# Altium schematic sheet A1-A2 Switches new.SchDoc: A1-A2 Switches new
size D; DrawnBy: C. Lewis; Engineer: C. Lewis; Address1: 4650 NORRIS CANYON RD.; Address2: SAN RAMON, CA 94583; DocumentNumber: 35133; Revision: D; SheetNumber: 6; SheetTotal: 20; PageSetup: Record=PageOptions|CenterHorizontal=True|CenterVertical=True|PrintScale=0.51|XCorrection=1.00|YCorrection=1.00|PrintKind=0|BorderSize=5000000|LeftOffset=0|BottomOffset=0|Orientation=2|PaperLength=1000|PaperWidth=1000|Scale=100|PaperSource=257|PrintQuality=600|MediaType=1|DitherType=10|PaperKind=11x17|PrintScaleMode=1
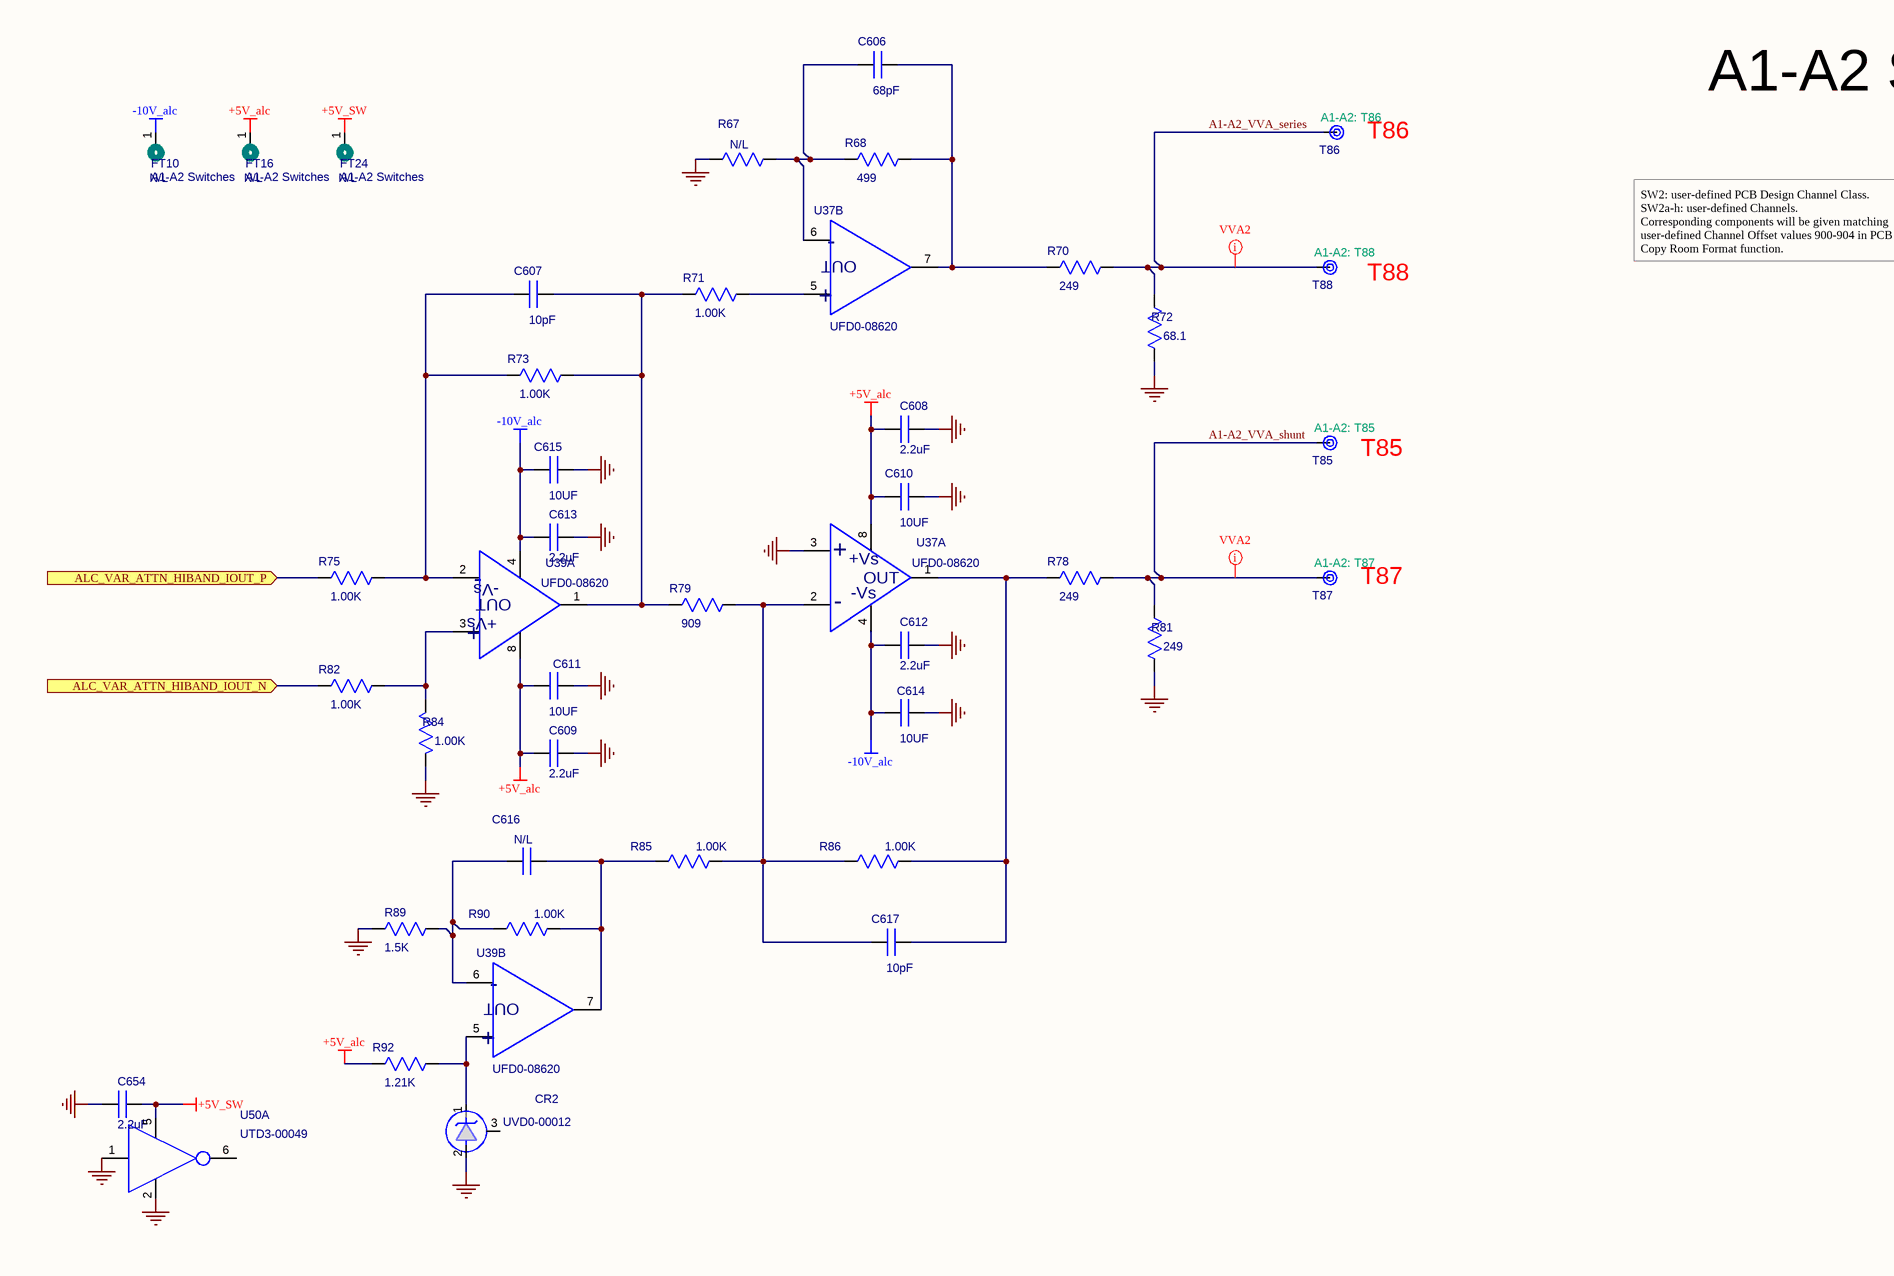
[diagram p0: A1-A2 Switches new.SchDoc, top left]
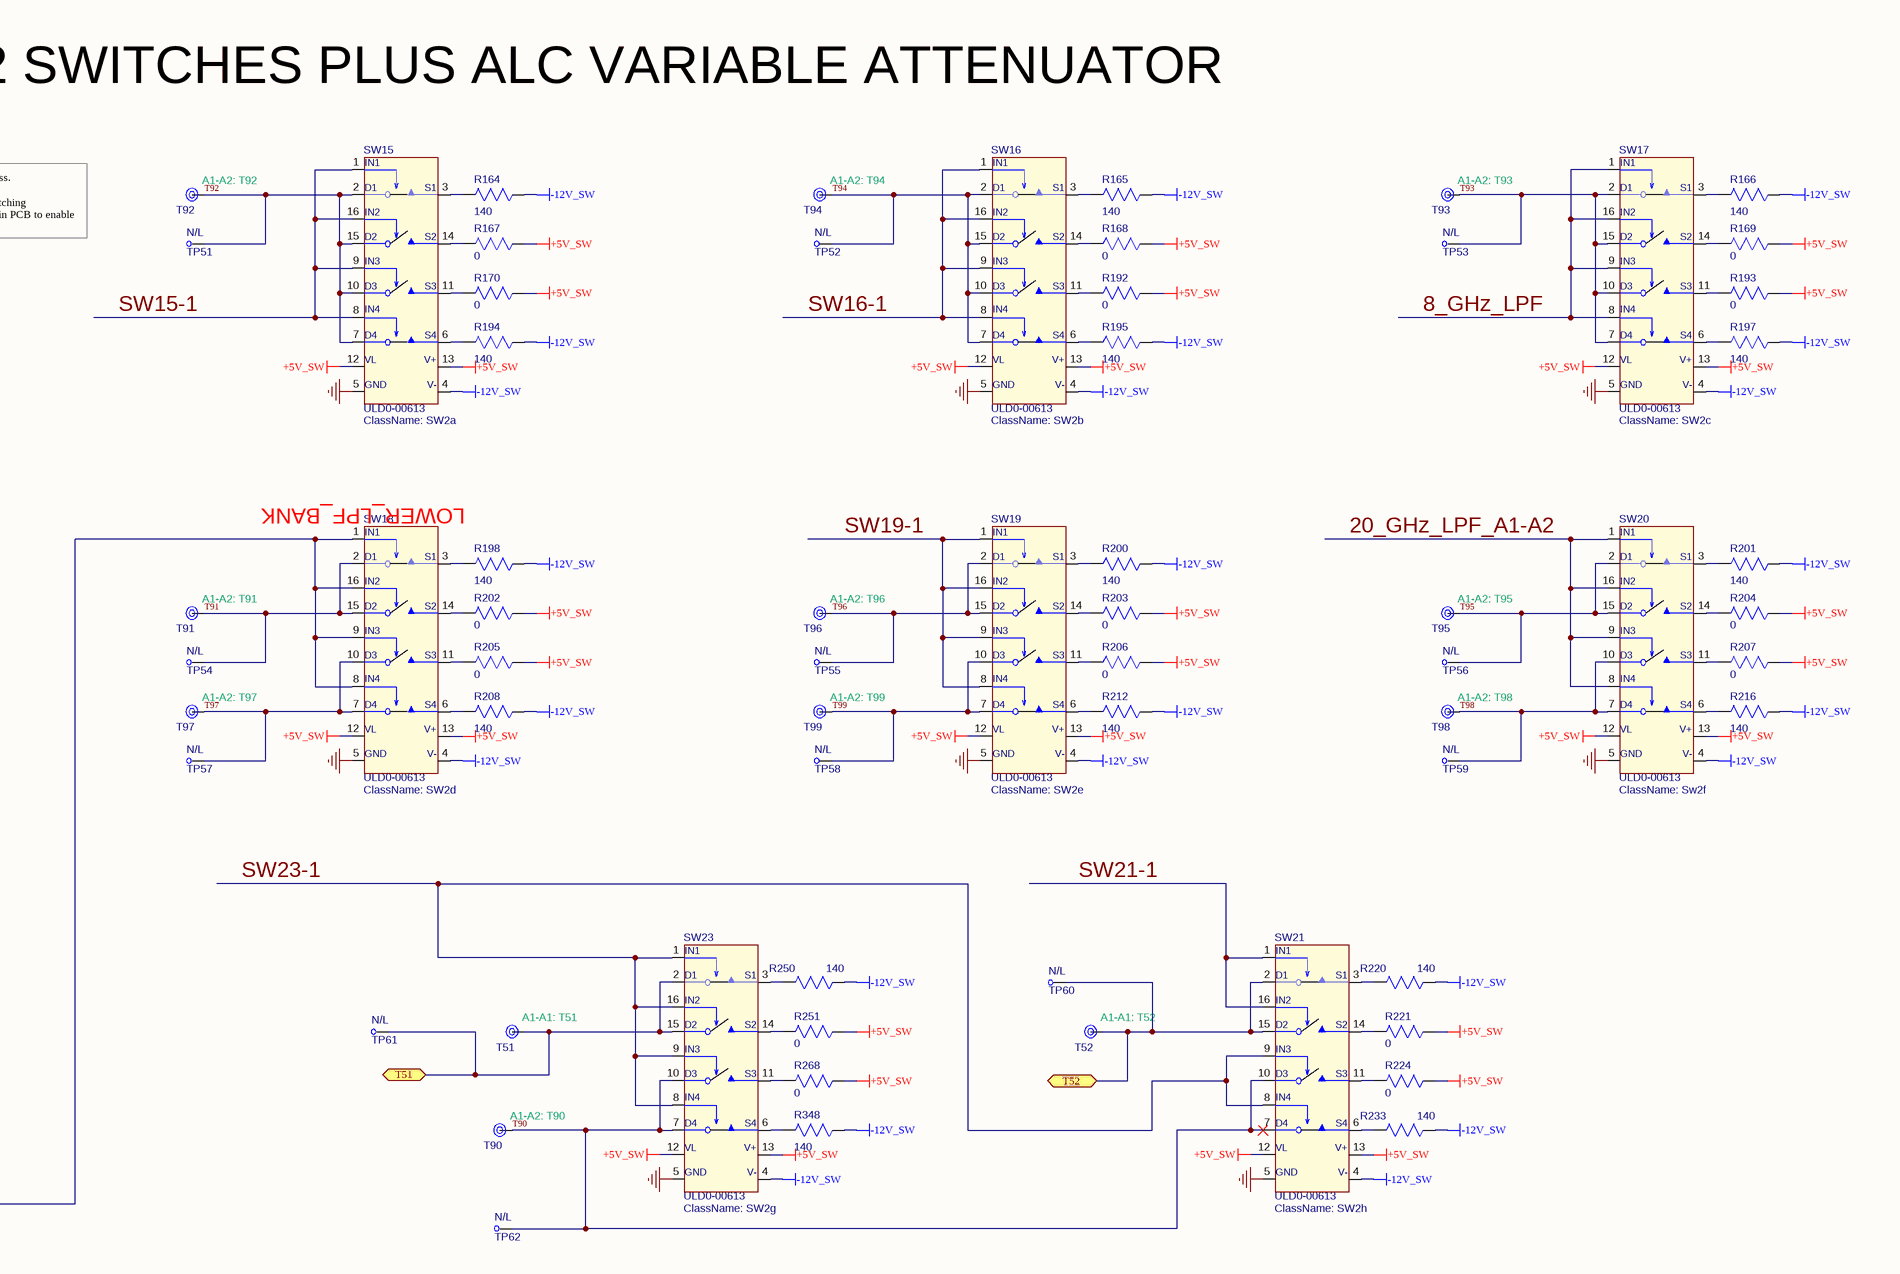
[diagram p1: A1-A2 Switches new.SchDoc, top right]
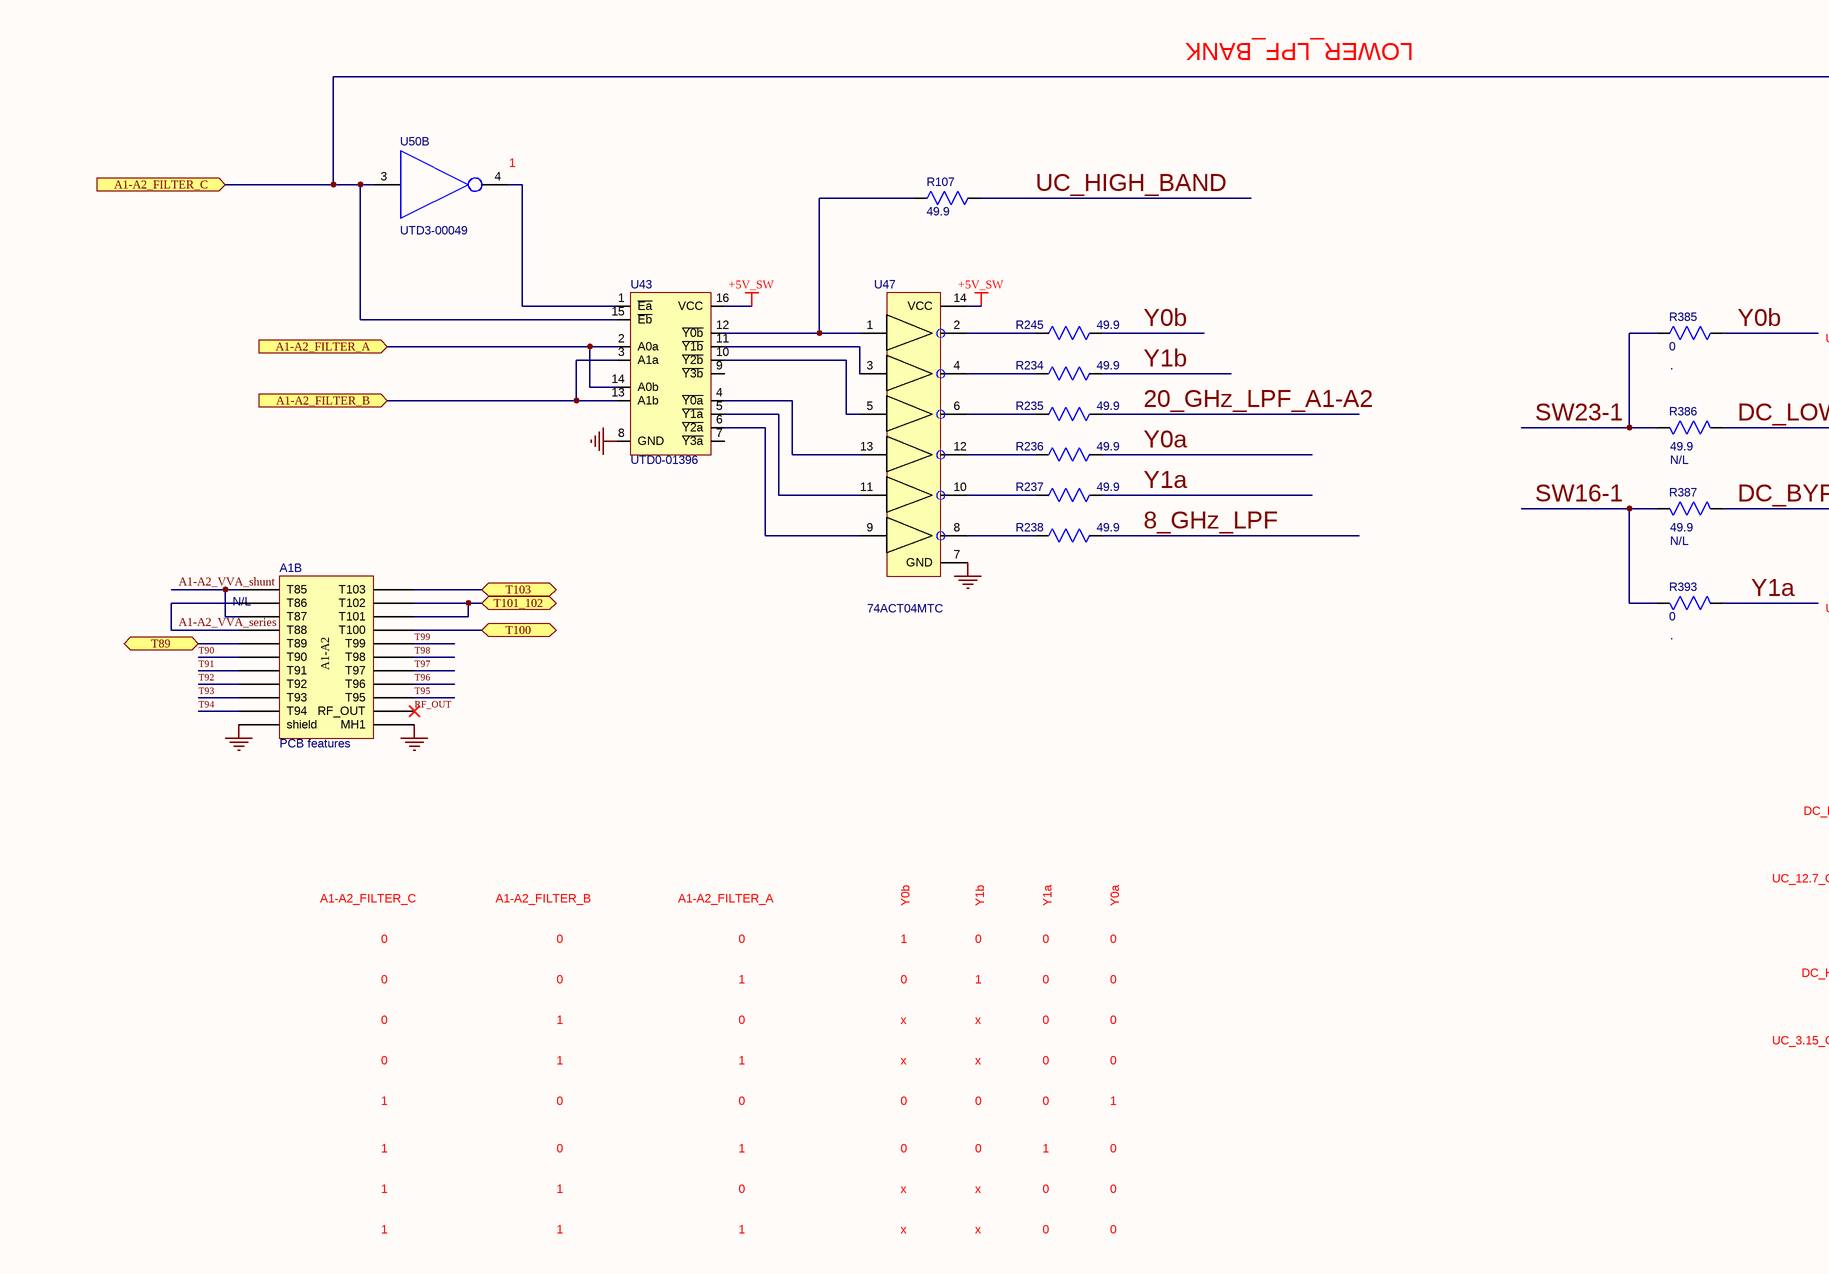
[diagram p2: A1-A2 Switches new.SchDoc, bottom left]
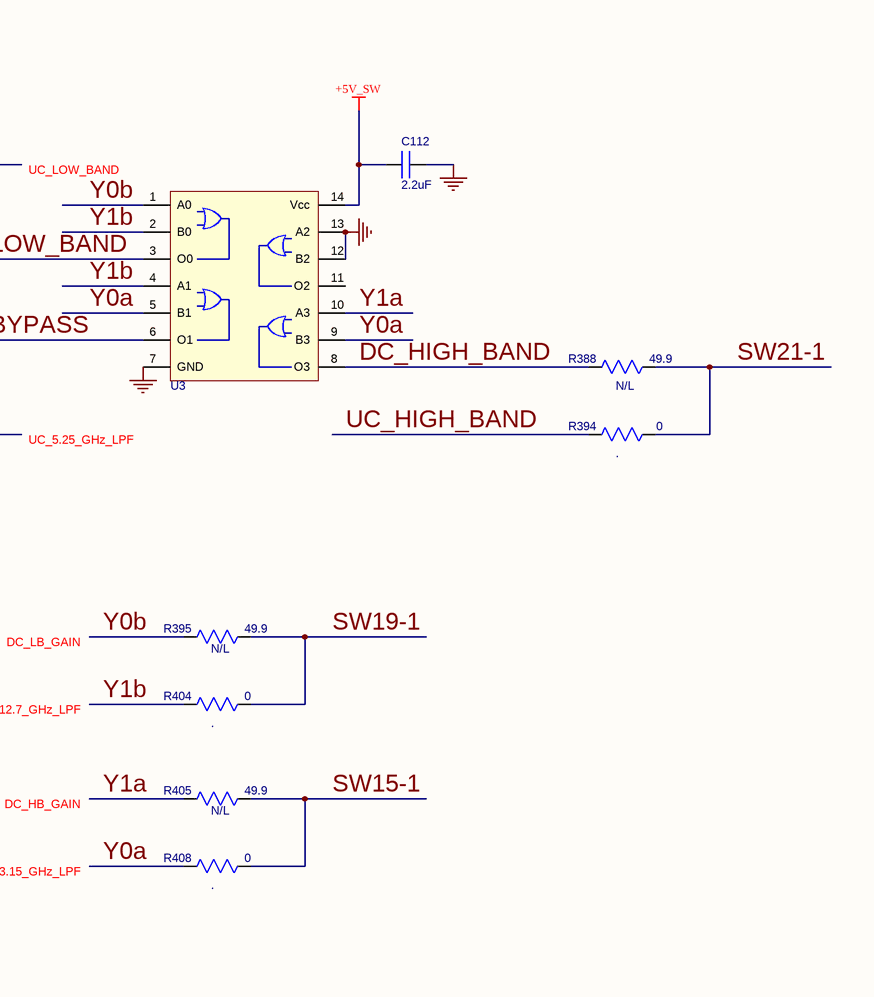
[diagram p3: A1-A2 Switches new.SchDoc, bottom right]

## Parts
A1  PCB features  NoLoad: N/L  [Hydra_A1_output_modules]  (part B of 2)  (no BOM)
C112  value 2.2uF  [CAP-0603-H035-N]  (hidden comment: CAP,CHP,2.2UF,10%,X5R;16V)
C606  value 68pF  [CAP-0402-N]  (hidden comment: 68pF;5%;COG;50V;CHIP;0402)
C607  value 10pF  [CAP-0402-N]  (hidden comment: 10 PF;5%;COG;>50V;CHIP;0402)
C608  value 2.2uF  [CAP-0603-H035-N]  (hidden comment: CAP,CHP,2.2UF,10%,X5R;16V)
C609  value 2.2uF  [CAP-0603-H035-N]  (hidden comment: CAP,CHP,2.2UF,10%,X5R;16V)
C610  10UF  [CAP-1210-N]
C611  10UF  [CAP-1210-N]
C612  value 2.2uF  [CAP-0603-H035-N]  (hidden comment: CAP,CHP,2.2UF,10%,X5R;16V)
C613  value 2.2uF  [CAP-0603-H035-N]  (hidden comment: CAP,CHP,2.2UF,10%,X5R;16V)
C614  10UF  [CAP-1210-N]
C615  10UF  [CAP-1210-N]
C616  NoLoad: N/L  [CAP-0402-N]  (hidden comment: 2.2pF;5%;COG;50V;CHIP;0402)
C617  value 10pF  [CAP-0402-N]  (hidden comment: 10 PF;5%;COG;>50V;CHIP;0402)
C654  value 2.2uF  [CAP-0603-H035-N]  (hidden comment: CAP,CHP,2.2UF,10%,X5R;16V)
CR2  VREF;1.235V;+/-4MV;.2MV 0-70 DEG C;SOT-23  [SOT23-N]  (value not drawn)
FT10  A1-A2 Switches  NoLoad: N/L  [FromToNode_ML2]  (net tie, no BOM)
FT16  A1-A2 Switches  NoLoad: N/L  [FromToNode_ML2]  (net tie, no BOM)
FT24  A1-A2 Switches  NoLoad: N/L  [FromToNode_ML2]  (net tie, no BOM)
R67  NoLoad: N/L  [RES-0402-N]  (hidden comment: 32.4K OHMS;.06W;1%;200PPM;FILM;CHIP;0402)
R68  value 499  [RES-0402-N]  (hidden comment: 499 OHMS; 1%; .1W; 100PPM; FILM; CHIP; 0402)
R70  value 249  [RES-0402-N]  (hidden comment: 249 OHMS; 1%; .1W; 100PPM; FILM; CHIP; 0402)
R71  value 1.00K  [RES-0402-N]  (hidden comment: 1.0K OHMS;.06W;1%;200PPM;FILM;CHIP;0402)
R72  value 68.1  [RES-0402-N]  (hidden comment: 68.1 OHMS;.06W;1%;200PPM;FILM;CHIP;0402)
R73  value 1.00K  [RES-0402-N]  (hidden comment: 1.0K OHMS;.06W;1%;200PPM;FILM;CHIP;0402)
R75  value 1.00K  [RES-0402-N]  (hidden comment: 1.0K OHMS;.06W;1%;200PPM;FILM;CHIP;0402)
R78  value 249  [RES-0402-N]  (hidden comment: 249 OHMS; 1%; .1W; 100PPM; FILM; CHIP; 0402)
R79  value 909  [RES-0402-N]  (hidden comment: 909 OHMS; 1%; .1W; 100PPM; FILM; CHIP; 0402)
R81  value 249  [RES-0402-N]  (hidden comment: 249 OHMS; 1%; .1W; 100PPM; FILM; CHIP; 0402)
R82  value 1.00K  [RES-0402-N]  (hidden comment: 1.0K OHMS;.06W;1%;200PPM;FILM;CHIP;0402)
R84  value 1.00K  [RES-0402-N]  (hidden comment: 1.0K OHMS;.06W;1%;200PPM;FILM;CHIP;0402)
R85  value 1.00K  [RES-0402-N]  (hidden comment: 1.0K OHMS;.06W;1%;200PPM;FILM;CHIP;0402)
R86  value 1.00K  [RES-0402-N]  (hidden comment: 1.0K OHMS;.06W;1%;200PPM;FILM;CHIP;0402)
R89  value 1.5K  [RES-0402-N]  (hidden comment: 1.50K Ohms;.06W;1%;±100PPM;CHIP RES;0402)
R90  value 1.00K  [RES-0402-N]  (hidden comment: 1.0K OHMS;.06W;1%;200PPM;FILM;CHIP;0402)
R92  value 1.21K  [RES-0402-N]  (hidden comment: 1.21K OHMS;.06W;1%;200PPM;FILM;CHIP;0402)
R107  value 49.9  [RES-0402-N]  (hidden comment: 49.9 OHMS;.06W;1%;200PPM;FILM;CHIP;0402)
R164  value 140  [RES-0402-N]  (hidden comment: 140 OHMS; 1%; .1W; 100PPM; FILM; CHIP; 0402)
R165  value 140  [RES-0402-N]  (hidden comment: 140 OHMS; 1%; .1W; 100PPM; FILM; CHIP; 0402)
R166  value 140  [RES-0402-N]  (hidden comment: 140 OHMS; 1%; .1W; 100PPM; FILM; CHIP; 0402)
R167  value 0  [RES-0603-N]  (hidden comment: JUMPER;.05 OHMS MAX;1A MAX;0603)
R168  value 0  [RES-0603-N]  (hidden comment: JUMPER;.05 OHMS MAX;1A MAX;0603)
R169  value 0  [RES-0603-N]  (hidden comment: JUMPER;.05 OHMS MAX;1A MAX;0603)
R170  value 0  [RES-0603-N]  (hidden comment: JUMPER;.05 OHMS MAX;1A MAX;0603)
R192  value 0  [RES-0603-N]  (hidden comment: JUMPER;.05 OHMS MAX;1A MAX;0603)
R193  value 0  [RES-0603-N]  (hidden comment: JUMPER;.05 OHMS MAX;1A MAX;0603)
R194  value 140  [RES-0402-N]  (hidden comment: 140 OHMS; 1%; .1W; 100PPM; FILM; CHIP; 0402)
R195  value 140  [RES-0402-N]  (hidden comment: 140 OHMS; 1%; .1W; 100PPM; FILM; CHIP; 0402)
R197  value 140  [RES-0402-N]  (hidden comment: 140 OHMS; 1%; .1W; 100PPM; FILM; CHIP; 0402)
R198  value 140  [RES-0402-N]  (hidden comment: 140 OHMS; 1%; .1W; 100PPM; FILM; CHIP; 0402)
R200  value 140  [RES-0402-N]  (hidden comment: 140 OHMS; 1%; .1W; 100PPM; FILM; CHIP; 0402)
R201  value 140  [RES-0402-N]  (hidden comment: 140 OHMS; 1%; .1W; 100PPM; FILM; CHIP; 0402)
R202  value 0  [RES-0603-N]  (hidden comment: JUMPER;.05 OHMS MAX;1A MAX;0603)
R203  value 0  [RES-0603-N]  (hidden comment: JUMPER;.05 OHMS MAX;1A MAX;0603)
R204  value 0  [RES-0603-N]  (hidden comment: JUMPER;.05 OHMS MAX;1A MAX;0603)
R205  value 0  [RES-0603-N]  (hidden comment: JUMPER;.05 OHMS MAX;1A MAX;0603)
R206  value 0  [RES-0603-N]  (hidden comment: JUMPER;.05 OHMS MAX;1A MAX;0603)
R207  value 0  [RES-0603-N]  (hidden comment: JUMPER;.05 OHMS MAX;1A MAX;0603)
R208  value 140  [RES-0402-N]  (hidden comment: 140 OHMS; 1%; .1W; 100PPM; FILM; CHIP; 0402)
R212  value 140  [RES-0402-N]  (hidden comment: 140 OHMS; 1%; .1W; 100PPM; FILM; CHIP; 0402)
R216  value 140  [RES-0402-N]  (hidden comment: 140 OHMS; 1%; .1W; 100PPM; FILM; CHIP; 0402)
R220  value 140  [RES-0603-N]  (hidden comment: 140 OHMS;.1W;1%;200PPM;FILM;CHIP;0603)
R221  value 0  [RES-0603-N]  (hidden comment: JUMPER;.05 OHMS MAX;1A MAX;0603)
R224  value 0  [RES-0603-N]  (hidden comment: JUMPER;.05 OHMS MAX;1A MAX;0603)
R233  value 140  [RES-0603-N]  (hidden comment: 140 OHMS;.1W;1%;200PPM;FILM;CHIP;0603)
R234  value 49.9  [RES-0402-N]  (hidden comment: 49.9 OHMS;.06W;1%;200PPM;FILM;CHIP;0402)
R235  value 49.9  [RES-0402-N]  (hidden comment: 49.9 OHMS;.06W;1%;200PPM;FILM;CHIP;0402)
R236  value 49.9  [RES-0402-N]  (hidden comment: 49.9 OHMS;.06W;1%;200PPM;FILM;CHIP;0402)
R237  value 49.9  [RES-0402-N]  (hidden comment: 49.9 OHMS;.06W;1%;200PPM;FILM;CHIP;0402)
R238  value 49.9  [RES-0402-N]  (hidden comment: 49.9 OHMS;.06W;1%;200PPM;FILM;CHIP;0402)
R245  value 49.9  [RES-0402-N]  (hidden comment: 49.9 OHMS;.06W;1%;200PPM;FILM;CHIP;0402)
R250  value 140  [RES-0603-N]  (hidden comment: 140 OHMS;.1W;1%;200PPM;FILM;CHIP;0603)
R251  value 0  [RES-0603-N]  (hidden comment: JUMPER;.05 OHMS MAX;1A MAX;0603)
R268  value 0  [RES-0603-N]  (hidden comment: JUMPER;.05 OHMS MAX;1A MAX;0603)
R348  value 140  [RES-0402-N]  (hidden comment: 140 OHMS; 1%; .1W; 100PPM; FILM; CHIP; 0402)
R385  UC_LOW_BAND  value 0  NoLoad: .  [RES-0402-N]
R386  value 49.9  NoLoad: N/L  [RES-0402-N]  (hidden comment: DC_LOW_BAND)
R387  value 49.9  NoLoad: N/L  [RES-0402-N]  (hidden comment: DC_BYPASS)
R388  value 49.9  NoLoad: N/L  [RES-0402-N]  (hidden comment: DC_HIGH_BAND)
R393  UC_5.25_GHz_LPF  value 0  NoLoad: .  [RES-0402-N]
R394  value 0  NoLoad: .  [RES-0402-N]  (hidden comment: UC_HIGH_BAND)
R395  DC_LB_GAIN  value 49.9  NoLoad: N/L  [RES-0402-N]
R404  UC_12.7_GHz_LPF  value 0  NoLoad: .  [RES-0402-N]
R405  DC_HB_GAIN  value 49.9  NoLoad: N/L  [RES-0402-N]
R408  UC_3.15_GHz_LPF  value 0  NoLoad: .  [RES-0402-N]
SW15  G_PN: ULD0-00613  ClassName: SW2a  [SOIC-16_Vishay]  (hidden comment: QUAD SPST ANALOG SW;200NS;45 OHM;SO-16)
SW16  G_PN: ULD0-00613  ClassName: SW2b  [SOIC-16_Vishay]  (hidden comment: QUAD SPST ANALOG SW;200NS;45 OHM;SO-16)
SW17  G_PN: ULD0-00613  ClassName: SW2c  [SOIC-16_Vishay]  (hidden comment: QUAD SPST ANALOG SW;200NS;45 OHM;SO-16)
SW18  G_PN: ULD0-00613  ClassName: SW2d  [SOIC-16_Vishay]  (hidden comment: QUAD SPST ANALOG SW;200NS;45 OHM;SO-16)
SW19  G_PN: ULD0-00613  ClassName: SW2e  [SOIC-16_Vishay]  (hidden comment: QUAD SPST ANALOG SW;200NS;45 OHM;SO-16)
SW20  G_PN: ULD0-00613  ClassName: Sw2f  [SOIC-16_Vishay]  (hidden comment: QUAD SPST ANALOG SW;200NS;45 OHM;SO-16)
SW21  G_PN: ULD0-00613  ClassName: SW2h  [SOIC-16_Vishay]  (hidden comment: QUAD SPST ANALOG SW;200NS;45 OHM;SO-16)
SW23  G_PN: ULD0-00613  ClassName: SW2g  [SOIC-16_Vishay]  (hidden comment: QUAD SPST ANALOG SW;200NS;45 OHM;SO-16)
T51  A1-A1: T51  [JIB0-11254]
T52  A1-A1: T52  [JIB0-11254]
T85  A1-A2: T85  [JIB0-11254]
T86  A1-A2: T86  [JIB0-11254]
T87  A1-A2: T87  [JIB0-11254]
T88  A1-A2: T88  [JIB0-11254]
T90  A1-A2: T90  [JIB0-11254]
T91  A1-A2: T91  [JIB0-11254]
T92  A1-A2: T92  [JIB0-11254]
T93  A1-A2: T93  [JIB0-11254]
T94  A1-A2: T94  [JIB0-11254]
T95  A1-A2: T95  [JIB0-11254]
T96  A1-A2: T96  [JIB0-11254]
T97  A1-A2: T97  [JIB0-11254]
T98  A1-A2: T98  [JIB0-11254]
T99  A1-A2: T99  [JIB0-11254]
TP51  NoLoad: N/L  [TP-060]  (hidden comment: .)  (no BOM)
TP52  NoLoad: N/L  [TP-060]  (hidden comment: .)  (no BOM)
TP53  NoLoad: N/L  [TP-060]  (hidden comment: .)  (no BOM)
TP54  NoLoad: N/L  [TP-060]  (hidden comment: .)  (no BOM)
TP55  NoLoad: N/L  [TP-060]  (hidden comment: .)  (no BOM)
TP56  NoLoad: N/L  [TP-060]  (hidden comment: .)  (no BOM)
TP57  NoLoad: N/L  [TP-060]  (hidden comment: .)  (no BOM)
TP58  NoLoad: N/L  [TP-060]  (hidden comment: .)  (no BOM)
TP59  NoLoad: N/L  [TP-060]  (hidden comment: .)  (no BOM)
TP60  NoLoad: N/L  [TP-060]  (hidden comment: .)  (no BOM)
TP61  NoLoad: N/L  [TP-060]  (hidden comment: .)  (no BOM)
TP62  NoLoad: N/L  [TP-060]  (hidden comment: .)  (no BOM)
U3  QUAD 2 IN OR GATES  [TSSOP-14_ON_SEMI]  (value not drawn)
U37  OP-AMP;DUAL:PRECISION;LOW CURRENT;LOW NOISE;WIDE  [SO8_MS-012]  (value not drawn)  (parts A,B of 2)
U39  OP-AMP;DUAL:PRECISION;LOW CURRENT;LOW NOISE;WIDE  [SO8_MS-012]  (value not drawn)  (parts A,B of 2)
U43  UTD0-01396  [TSSOP-16_ONSEMI]
U47  M_PN: 74ACT04MTC  [TSOP65P640X120-14L]  (hidden comment: 74ACT04MTC HEX INVERTER;SMT;TSSOP-14)
U50  INVERTER;DUAL;1.65-5.5V SUP;2NS TPD;SC70-6  [SOT-363_419B]  (value not drawn)  (parts A,B of 2)

## Ports
A1-A2_FILTER_A, A1-A2_FILTER_B, A1-A2_FILTER_C, ALC_VAR_ATTN_HIBAND_IOUT_N, ALC_VAR_ATTN_HIBAND_IOUT_P, T51, T52, T89, T100, T101_102, T103

## Nets
+5V_alc: C608.1 C609.1 C610.1 C611.1 FT16.1 R92.1 U37.8(V+) U39.8(V+)
+5V_SW: C112.1 C654.1 FT24.1 R167.2 R168.2 R169.2 R170.2 R192.2 R193.2 R202.2 R203.2 R204.2 R205.2 R206.2 R207.2 R221.2 R224.2 R251.2 R268.2 SW15.12(VL) SW15.13(V+) SW16.12(VL) SW16.13(V+) SW17.12(VL) SW17.13(V+) SW18.12(VL) SW18.13(V+) SW19.12(VL) SW19.13(V+) SW20.12(VL) SW20.13(V+) SW21.12(VL) SW21.13(V+) SW23.12(VL) SW23.13(V+) U3.14(Vcc) U43.16(VCC) U47.14(VCC) U50.5(V+)
-10V_alc: C612.1 C613.1 C614.1 C615.1 FT10.1 U37.4(V-) U39.4(V-)
-12V_SW: R164.2 R165.2 R166.2 R194.2 R195.2 R197.2 R198.2 R200.2 R201.2 R208.2 R212.2 R216.2 R220.2 R233.2 R250.2 R348.2 SW15.4(VL) SW16.4(VL) SW17.4(VL) SW18.4(VL) SW19.4(VL) SW20.4(VL) SW21.4(VL) SW23.4(VL)
GND: A1.A1-A2_shield(shield) A1.MH1 C112.2 C608.2 C609.2 C610.2 C611.2 C612.2 C613.2 C614.2 C615.2 C654.2 CR2.2 R67.1 R72.1 R81.1 R84.2 R89.1 SW15.5(IN2) SW16.5(IN2) SW17.5(IN2) SW18.5(IN2) SW19.5(IN2) SW20.5(IN2) SW21.5(IN2) SW23.5(IN2) U3.7(GND) U3.12(B2) U3.13(A2) U37.3(+IN) U43.8(GND) U47.7(GND) U50.1(IN) U50.2(V-)
8_GHz_LPF: R238.2 SW17.1(IN1) SW17.8(IN4) SW17.9(IN3) SW17.16(S1)
20_GHz_LPF_A1-A2: R235.2 SW20.1(IN1) SW20.8(IN4) SW20.9(IN3) SW20.16(S1)
A1-A2_FILTER_A: U43.2(A0a) U43.14(A0b) ; port A1-A2_FILTER_A
A1-A2_FILTER_B: U43.3(A1a) U43.13(A1b) ; port A1-A2_FILTER_B
A1-A2_FILTER_C: SW18.1(IN1) SW18.8(IN4) SW18.9(IN3) SW18.16(S1) U43.15(~{Eb}) U50.3(IN) ; port A1-A2_FILTER_C
A1-A2_VVA_series: A1.T86 A1.T88 R70.2 R72.2 T86.1 T88.1
A1-A2_VVA_shunt: A1.T85 A1.T87 R78.2 R81.2 T85.1 T87.1
ALC_VAR_ATTN_HIBAND_IOUT_N: R82.1 ; port ALC_VAR_ATTN_HIBAND_IOUT_N
ALC_VAR_ATTN_HIBAND_IOUT_P: R75.1 ; port ALC_VAR_ATTN_HIBAND_IOUT_P
DC_BYPASS: R387.1 U3.6(O1)
DC_HIGH_BAND: R388.1 U3.8(O3)
DC_LOW_BAND: R386.1 U3.3(O0)
RF_OUT: A1.MH_RF_OUT(RF_OUT)
SW15-1: R405.2 R408.2 SW15.1(IN1) SW15.8(IN4) SW15.9(IN3) SW15.16(S1)
SW16-1: R387.2 R393.2 SW16.1(IN1) SW16.8(IN4) SW16.9(IN3) SW16.16(S1)
SW19-1: R395.2 R404.2 SW19.1(IN1) SW19.8(IN4) SW19.9(IN3) SW19.16(S1)
SW21-1: R388.2 R394.2 SW21.1(IN1) SW21.16(S1)
SW23-1: R385.2 R386.2 SW21.8(IN4) SW21.9(IN3) SW23.1(IN1) SW23.8(IN4) SW23.9(IN3) SW23.16(S1)
T51: SW23.2(D1) SW23.15(D2) T51.1 TP61.1 ; port T51
T52: SW21.2(D1) SW21.15(D2) T52.1 TP60.1 ; port T52
T89: A1.T89 ; port T89
T90: A1.T90 SW21.7(D4) SW21.10(D3) SW23.7(D4) SW23.10(D3) T90.1 TP62.1
T91: A1.T91 SW18.2(D1) SW18.15(D2) T91.1 TP54.1
T92: A1.T92 SW15.2(D1) SW15.7(D4) SW15.10(D3) SW15.15(D2) T92.1 TP51.1
T93: A1.T93 SW17.2(D1) SW17.7(D4) SW17.10(D3) SW17.15(D2) T93.1 TP53.1
T94: A1.T94 SW16.2(D1) SW16.7(D4) SW16.10(D3) SW16.15(D2) T94.1 TP52.1
T95: A1.T95 SW20.2(D1) SW20.15(D2) T95.1 TP56.1
T96: A1.T96 SW19.2(D1) SW19.15(D2) T96.1 TP55.1
T97: A1.T97 SW18.7(D4) SW18.10(D3) T97.1 TP57.1
T98: A1.T98 SW20.7(D4) SW20.10(D3) T98.1 TP59.1
T99: A1.T99 SW19.7(D4) SW19.10(D3) T99.1 TP58.1
T100: A1.T100 ; port T100
T101_102: A1.T101 A1.T102 ; port T101_102
T103: A1.T103 ; port T103
UC_HIGH_BAND: R107.2 R394.1
Y0a: R236.2 R408.1 U3.5(B1) U3.9(B3)
Y0b: R245.2 R385.1 R395.1 U3.1(A0)
Y1a: R237.2 R393.1 R405.1 U3.10(A3)
Y1b: R234.2 R404.1 U3.2(B0) U3.4(A1)
NetC606_1: C606.1 R67.2 R68.1 U37.6(-IN)
NetC606_2: C606.2 R68.2 R70.1 U37.7(OUT)
NetC607_1: C607.1 R73.1 R75.2 U39.2(-IN)
NetC607_2: C607.2 R71.1 R73.2 R79.1 U39.1(OUT)
NetC616_1: C616.1 R89.2 R90.1 U39.6(-IN)
NetC616_2: C616.2 R85.1 R90.2 U39.7(OUT)
NetC617_1: C617.1 R79.2 R85.2 R86.1 U37.2(-IN)
NetC617_2: C617.2 R78.1 R86.2 U37.1(OUT)
NetCR2_1: CR2.1(C) R92.2 U39.5(+IN)
NetR71_2: R71.2 U37.5(+IN)
NetR82_2: R82.2 R84.1 U39.3(+IN)
NetR107_1: R107.1 U43.12(~{Y0b}) U47.1
NetR164_1: R164.1 SW15.3(S1)
NetR165_1: R165.1 SW16.3(S1)
NetR166_1: R166.1 SW17.3(S1)
NetR167_1: R167.1 SW15.14(S2)
NetR168_1: R168.1 SW16.14(S2)
NetR169_1: R169.1 SW17.14(S2)
NetR170_1: R170.1 SW15.11(S3)
NetR192_1: R192.1 SW16.11(S3)
NetR193_1: R193.1 SW17.11(S3)
NetR194_1: R194.1 SW15.6(S4)
NetR195_1: R195.1 SW16.6(S4)
NetR197_1: R197.1 SW17.6(S4)
NetR198_1: R198.1 SW18.3(S1)
NetR200_1: R200.1 SW19.3(S1)
NetR201_1: R201.1 SW20.3(S1)
NetR202_1: R202.1 SW18.14(S2)
NetR203_1: R203.1 SW19.14(S2)
NetR204_1: R204.1 SW20.14(S2)
NetR205_1: R205.1 SW18.11(S3)
NetR206_1: R206.1 SW19.11(S3)
NetR207_1: R207.1 SW20.11(S3)
NetR208_1: R208.1 SW18.6(S4)
NetR212_1: R212.1 SW19.6(S4)
NetR216_1: R216.1 SW20.6(S4)
NetR220_1: R220.1 SW21.3(S1)
NetR221_1: R221.1 SW21.14(S2)
NetR224_1: R224.1 SW21.11(S3)
NetR233_1: R233.1 SW21.6(S4)
NetR234_1: R234.1 U47.4
NetR235_1: R235.1 U47.6
NetR236_1: R236.1 U47.12
NetR237_1: R237.1 U47.10
NetR238_1: R238.1 U47.8
NetR245_1: R245.1 U47.2
NetR250_1: R250.1 SW23.3(S1)
NetR251_1: R251.1 SW23.14(S2)
NetR268_1: R268.1 SW23.11(S3)
NetR348_1: R348.1 SW23.6(S4)
NetU43_1: U43.1(~{Ea}) U50.4(OUT)
NetU43_4: U43.4(~{Y0a}) U47.13
NetU43_5: U43.5(~{Y1a}) U47.11
NetU43_6: U43.6(~{Y2a}) U47.9
NetU43_10: U43.10(~{Y2b}) U47.5
NetU43_11: U43.11(~{Y1b}) U47.3

Not connected (* = marked no-connect by the designer): CR2 3(case); U3 11(O2); U43 7(~{Y3a}) 9(~{Y3b}); U50 6(OUT)

## Layout directives
net class VVA2: A1-A2_VVA_series, A1-A2_VVA_shunt

## Notes on the sheet
- A1-A2 SWITCHES PLUS ALC VARIABLE ATTENUATOR
- (near T86) T86
- (near T88) T88
- SW2: user-defined PCB Design Channel Class.
  SW2a-h: user-defined Channels.
  Corresponding components will be given matching user-defined Channel Offset values 900-904 in PCB to enable Copy Room Format function.
- (near T85) T85
- LOWER_LPF_BANK
- (near T87) T87
- (near U50) 1
- A1-A2_FILTER_C
- 0
- A1-A2_FILTER_B
- A1-A2_FILTER_A
- 1
- Y0b
- Y1b
- Y1a
- Y0a
- x
- Title
- Sheet Title
- PRINTED DOCUMENT IS CONSIDERED UNCONTROLLED. VERIFY REVISION IN PLM SYSTEM.
- THIS DOCUMENT CONTAINS PROPRIETARY INFORMATION. DESIGN RIGHTS BELONG TO GIGA-TRONICS AND MAY NOT BE REPRODUCED WITHOUT WRITTEN AUTHORIZATION FOR ANY REASON EXCEPT CALIBRATION, OPERATION AND MAINTENANCE.
- Size
- CAGE CODE
- Filename
- D
- Document Number
- 58900
- Date
- Sheet
- Rev
- of
- (in symbol Hydra A1 output modules, part B) A1-A2
- (in symbol UFD0-08620, part A) -; -Vs; +Vs; +
- (in symbol UFD0-08620, part B) -; +
- (in symbol ULD0-00613_1) GND; V-

## Library data of the parts
A1 = Hydra A1 output modules: Hydra A1 output modules (PCB features); G_PN: 35123-35127; level: 1; Approved: *; MFGR: *; Value: *; item_number: 35123-35127
C112 C608 C609 C612 C613 C654 = CK45-05220: Approved: CL; NoLoad: .; MFGR: ANY; level: 1; line_number: 113; G_PN: CK45-05220; ModifyDate: 4/30/15; M_PN: ANY; item_number: CK45-05220
C606 = CK40-00680: Approved: CL; NoLoad: .; MFGR: ANY; level: 1; line_number: 235; G_PN: CK40-00680; ModifyDate: 02/22/12; M_PN: ANY; item_number: CK40-00680
C607 C617 = CK40-00100: Approved: CL; NoLoad: .; MFGR: ANY; level: 1; line_number: 110; G_PN: CK40-00100; ModifyDate: 4/9/12; M_PN: ANY; item_number: CK40-00100
C610 C611 C614 C615 = CK60-06100: 10uF 10% X7R CERAMIC 16V 1210 CHIP; Approved: XiaoXiao; NoLoad: .; MFGR: ANY; level: 1; line_number: 185; ModifyDate: 10/04/2012; M_PN: ANY; G_PN: CK60-06100; Value: 10UF; item_number: CK60-06100
C616 = CK40-00022: Approved: CL; MFGR: ANY; level: 1; G_PN: CK40-00022; ModifyDate: 04/11/12; M_PN: ANY; Value: 2.2pF; item_number: CK40-00022
CR2 = UVD0-00012: M_PN: LM385M3-1.2; MFGR: TI; NoLoad: .; Approved: CL; Value: LM385M3-1.2; level: 1; line_number: 325; ModifyDate: 3/25/13; G_PN: UVD0-00012; item_number: UVD0-00012
FT10 FT16 FT24 = FromToNode: level: 1; Approved: *; G_PN: *; MFGR: *; Value: *
R67 = RK35-23240: Approved: CL; M_PN: ANY; level: 1; G_PN: RK35-23240; ModifyDate: 02/04/13; MFGR: ANY; Value: 32.4K; item_number: RK35-23240
R68 = RK35-04990: NoLoad: .; Approved: CL; MFGR: ANY; level: 1; line_number: 1015; G_PN: RK35-04990; ModifyDate: 02/22/12; M_PN: ANY; item_number: RK35-04990
R70 R78 R81 = RK35-02490: NoLoad: .; Approved: CL; MFGR: ANY; level: 1; line_number: 1020; G_PN: RK35-02490; ModifyDate: 02/22/12; M_PN: ANY; item_number: RK35-02490
R71 R73 R75 R82 R84-R86 R90 = RK35-11000: Approved: CL; NoLoad: .; MFGR: ANY; level: 1; line_number: 1025; G_PN: RK35-11000; ModifyDate: 02/22/12; M_PN: ANY; item_number: RK35-11000
R72 = RK35-00681: NoLoad: .; Approved: CL; MFGR: ANY; level: 1; line_number: 1030; G_PN: RK35-00681; ModifyDate: 3/26/13; M_PN: ANY; item_number: RK35-00681
R79 = RK35-09090: NoLoad: .; Approved: CL; MFGR: ANY; level: 1; line_number: 1040; G_PN: RK35-09090; ModifyDate: 3/25/13; M_PN: ANY; item_number: RK35-09090
R89 = RK35-11500: Approved: CL; NoLoad: .; MFGR: ANY; level: 1; line_number: 1045; G_PN: RK35-11500; ModifyDate: 4/11/12; M_PN: ANY; item_number: RK35-11500
R92 = RK35-11210: NoLoad: .; Approved: CL; MFGR: ANY; level: 1; line_number: 1050; G_PN: RK35-11210; ModifyDate: 02/22/13; M_PN: ANY; item_number: RK35-11210
R107 R234-R238 R245 = RK35-00499: Approved: CL; NoLoad: .; MFGR: ANY; level: 1; line_number: 650; G_PN: RK35-00499; ModifyDate: 02/22/12; M_PN: ANY; item_number: RK35-00499
R164-R166 R194 R195 R197 R198 R200 R201 R208 R212 R216 R348 = RK35-01400: NoLoad: .; MFGR: ANY; Approved: CL; level: 1; line_number: 975; ModifyDate: 4/11/12; M_PN: ANY; G_PN: RK35-01400; item_number: RK35-01400
  R164 R194: ClassName: SW2a
  R165 R195: ClassName: SW2b
  R166 R197: ClassName: SW2c
  R198 R208: ClassName: SW2d
  R200 R212: ClassName: SW2e
  R201 R216: ClassName: Sw2f
  R348: ClassName: SW2g
R167-R170 R192 R193 R202-R207 R221 R224 R251 R268 = RK40-00000: NoLoad: .; MFGR: ANY; Approved: CL; level: 1; line_number: 710; ModifyDate: 3/27/13; M_PN: ANY; G_PN: RK40-00000; item_number: RK40-00000
  R167 R170: ClassName: SW2a
  R168 R192: ClassName: SW2b
  R169 R193: ClassName: SW2c
  R202 R205: ClassName: SW2d
  R203 R206: ClassName: SW2e
  R204 R207: ClassName: Sw2f
  R221 R224: ClassName: SW2h
  R251 R268: ClassName: SW2g
R220 R233 R250 = RK41-01400: NoLoad: .; MFGR: VENKEL; M_PN: CR0603-10W-1300FT; Approved: CL; level: 1; line_number: 690; ModifyDate: 3/27/13; G_PN: RK41-01400; item_number: RK41-01400
  R220 R233: ClassName: SW2h
  R250: ClassName: SW2g
R385 R393 R394 R404 R408 = RK35-00000: JUMPER;0 OHMS;SMT;0402; Approved: CL; MFGR: ANY; level: 1; line_number: 1005; G_PN: RK35-00000; ModifyDate: 02/22/12; M_PN: ANY; item_number: RK35-00000
R386-R388 R395 R405 = RK35-00499: 49.9 OHMS;.06W;1%;200PPM;FILM;CHIP;0402; Approved: CL; MFGR: ANY; level: 1; line_number: 650; G_PN: RK35-00499; ModifyDate: 02/22/12; M_PN: ANY; item_number: RK35-00499
SW15-SW21 SW23 = ULD0-00613_1: Value: DG613DY; MFGR: VISHAY; NoLoad: .; Approved: NM; level: 1; line_number: 1060; ModifyDate: 2/20/13; M_PN: DG613DY; item_number: ULD0-00613
T51 T52 T85-T88 T90-T99 = JIB0-11254: SOCKET;SINGLE;.018-.040 ID X .254;OPEN;GLD; NoLoad: .; MFGR: AMP; Approved: NM; M_PN: 380635; level: 1; line_number: 1065; ModifyDate: 11/30/12; G_PN: JIB0-11254; item_number: JIB0-11254
TP51-TP62 = TP-060: Approved: NM; level: 1; MFGR: N/A; M_PN: N/A
U3 = UTD0-00329: Value: 74VHC32MTCX; NoLoad: .; Approved: CL; MFGR: FAIRCHILD; level: 1; line_number: 1355; ModifyDate: 3/27/13; G_PN: UTD0-00329; M_PN: 74VHC32MTCX; item_number: UTD0-00329
U37 U39 = UFD0-08620: Value: AD8620; NoLoad: .; Approved: CL; MFGR: ANALOG DEVICES; level: 1; line_number: 1200; ModifyDate: 02/20/13; M_PN: AD8620; G_PN: UFD0-08620; item_number: UFD0-08620
U43 = UTD0-01396: 2 TO 4 DECODER/DEMULTIPLEXER;74VHC139 LOGIC;SO-16; Approved: CL; MFGR: ON SEMI; M_PN: MC74VHC139DTR2G; NoLoad: .; Value: MC74VHC139DTR2G; level: 1; line_number: 1230; G_PN: UTD0-01396; ModifyDate: 3/28/13; item_number: UTD0-01396
U47 = UTD4-00046: MFGR: Fairchild; NoLoad: .; Approved: NM; level: 1; line_number: 1175; Value: *; ModifyDate: 10/27/12; G_PN: UTD4-00046; item_number: UTD4-00046
U50 = UTD3-00049: Value: NL27WZ04DFT2G; NoLoad: .; Approved: CL; MFGR: ON SEMI; level: 1; line_number: 1250; ModifyDate: 02/22/12; M_PN: NL27WZ04DFT2G; G_PN: UTD3-00049; item_number: UTD3-00049